# EAGLE design bosch_pressure_v11 (EAGLE 5.09)
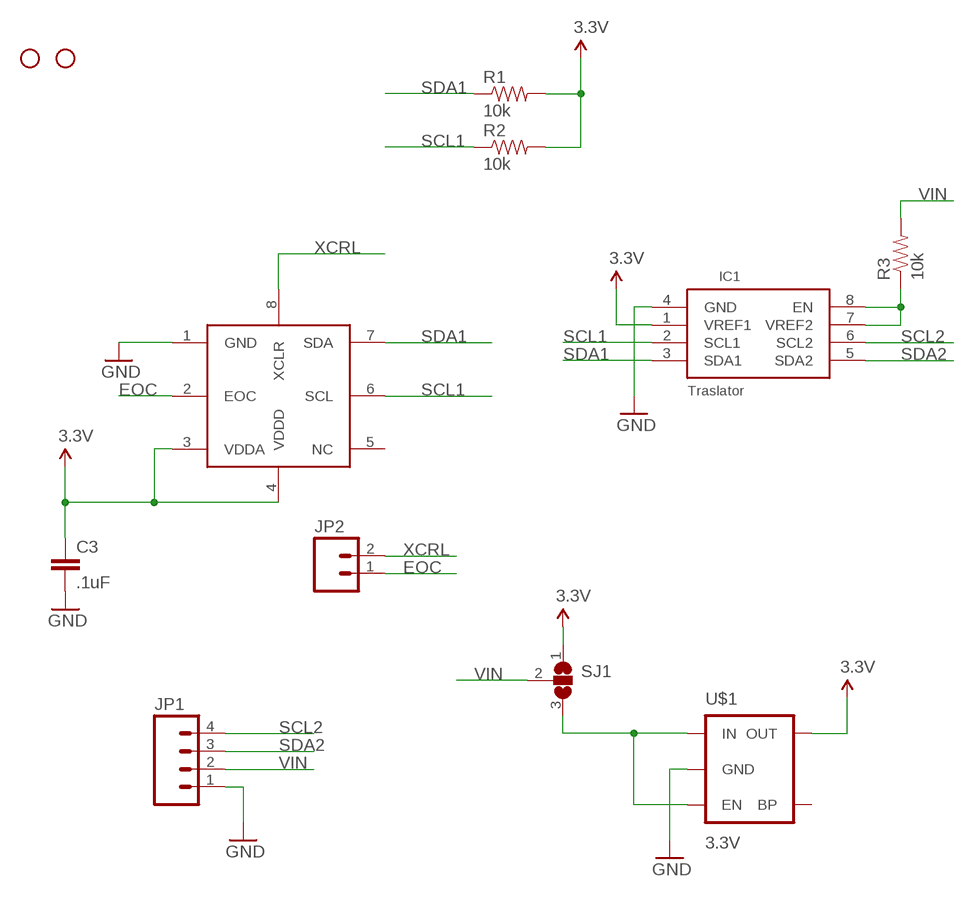
[diagram p0: schematic, sheet 1]

## Parts
C3  .1uF  CAP0402  [C0402]
IC1  Traslator  PCA9306DC  [VSSOP8]
JP1  M04PTH  [1X04]
JP2  M02PTH  [1X02]
R1  10k  RESISTOR0402  [C0402]
R2  10k  RESISTOR0402  [C0402]
R3  10k  RESISTOR0402  [C0402]
SJ1  SOLDERJUMPER_2WAYS  [SJ_3]
U$1  3.3V  V_REG_LDOSMD  [SOT23-5]
U$2  STAND-OFF  [STAND-OFF]
U$3  STAND-OFF  [STAND-OFF]
U$7  BMP085  [BMP085]

## Nets
3.3V: C3.1 IC1.1(VREF1) R1.2 R2.2 SJ1.1 U$1.5(OUT) U$7.3(VDDA) U$7.4(VDDD)
EOC: JP2.1 U$7.2(EOC)
GND: C3.2 IC1.4(GND) JP1.1 U$1.2(GND) U$7.1(GND)
N$1: IC1.7(VREF2) IC1.8(EN) R3.1
N$4: SJ1.3 U$1.1(IN) U$1.3(EN)
SCL1: IC1.2(SCL1) R2.1 U$7.6(SCL)
SCL2: IC1.6(SCL2) JP1.4
SDA1: IC1.3(SDA1) R1.1 U$7.7(SDA)
SDA2: IC1.5(SDA2) JP1.3
VIN: JP1.2 R3.2 SJ1.2
XCRL: JP2.2 U$7.8(XCLR)
Unconnected: U$1.4(BP) U$7.5(NC)

## Library data of the parts
C3 = DIYdrones3:CAP: Capacitor Standard 0603 ceramic capacitor, and 0.1" leaded capacitor.
IC1 = DIYdrones_082610:PCA9306DC
JP1 = SparkFun:M04: Header 4 Standard 4-pin 0.1" header. Use with straight break away headers (SKU : PRT-00116), right angle break away headers (PRT-00553), swiss pins (PRT-00743), machine pins (PRT-00117), and female headers (PRT-00115). Molex polarized connector foot print use with SKU : PRT-08231 with associated crimp pins and housings.
JP2 = SparkFun:M02: Header 2 Standard 2-pin 0.1" header. Use with straight break away headers (SKU : PRT-00116), right angle break away headers (PRT-00553), swiss pins (PRT-00743), machine pins (PRT-00117), and female headers (PRT-00115). Molex polarized connector foot print use with SKU : PRT-08233 with associated crimp pins and housings.
R1-R3 = DIYdrones3:RESISTOR: Resistor Basic schematic elements and footprints for 0603, 1206, and PTH 1/10th watt (small) resistors.
SJ1 = DIYdrones3:SOLDERJUMPER_2WAY: Solder Jumper 2 way solder jumper
U$1 = DIYdrones3:V_REG_LDO: Voltage Regulator LDO Standard 150mA LDO voltage regulator in SOT-23 layout. Micrel part MIC5205. BP (by-pass) pin is used to lower output noise with 470pF cap.
U$2 U$3 = DIYdrones3:STAND-OFF: Stand Off This is the mechanical footprint for a #4 phillips button head screw. Use the keepout ring to avoid running the screw head into surrounding components. SKU : PRT-00447
U$7 = SparkFun:BMP085

## Board
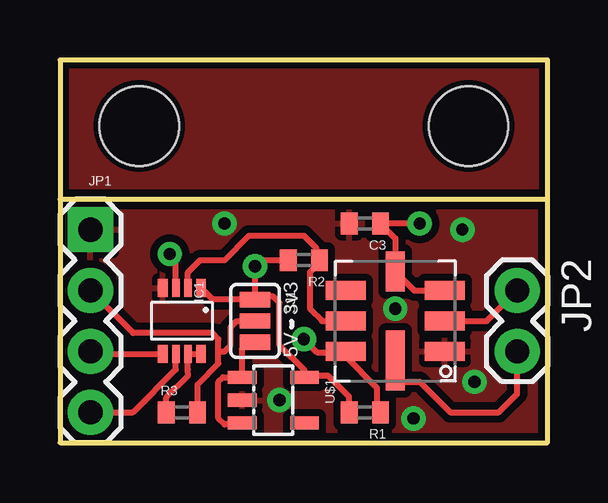
[diagram p1: board, top side]
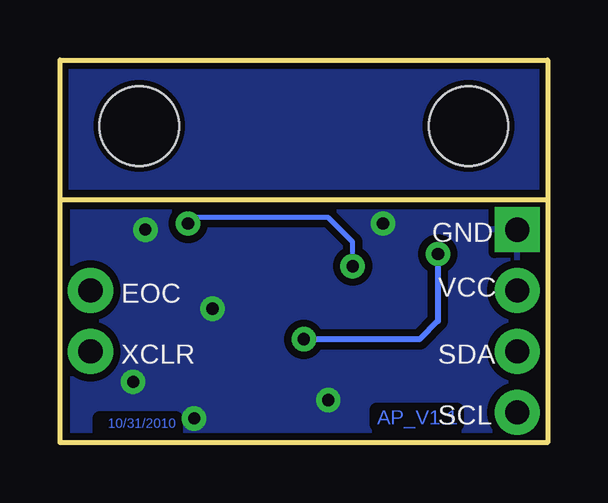
[diagram p2: board, bottom side, seen from below]

Size 20.32 x 15.97 mm. Coordinates in mm from the lower left corner, seen from the top.
Outline: 20.32,10.15 20.32,0 0,0 0,10.15 20.32,10.15
Outline: 0,10.16 0,15.97 20.32,15.97 20.32,10.15
Copper layers (1*16): Top 0.035mm / dielectric 1.5mm / Bottom 0.035mm
Design rules "SparkFun": minimum track width 8mil, minimum drill 20mil, track to track 8mil, track to pad 8mil, pad to pad 8mil, via to via 8mil, smd to smd 8mil, copper to edge 10mil, drill to drill 8mil, minimum pad ring 12mil, minimum via ring 10mil, stop-mask expansion 4mil, vias tented up to drill 25mil, thermal gap 10mil

### Footprints (pad centres in the part's own frame; a part is rotated, then mirrored left to right if it is on the bottom)
C0402 = smd 0.7 x 0.9: 1 -0.65,0; 2 0.65,0
VSSOP8 = smd 0.75 x 0.4: 1 -1.375,0.8; 4 -1.375,-0.8; 5 1.375,-0.8; 8 1.375,0.8 | smd 0.75 x 0.3: 2 -1.375,0.25; 3 -1.375,-0.25; 6 1.375,-0.25; 7 1.375,0.25
1X04 = drill 1.016 pad 1.88 square: 1 0,0 | drill 1.016 pad 1.88 round: 2 2.54,0; 3 5.08,0; 4 7.62,0
1X02 = drill 1.016 pad 1.88 round: 1 0,0; 2 2.54,0
SJ_3 = smd 0.635 x 1.27: 1 -0.889,0; 2 0,0; 3 0.889,0
SOT23-5 = smd 0.55 x 1.2: 1 -0.95,-1.3; 2 0,-1.3; 3 0.95,-1.3; 4 0.95,1.3; 5 -0.95,1.3
STAND-OFF = hole 3.302: 0,0
BMP085 = smd 1.67 x 0.8: 1 -2.065,1.27; 2 -2.065,0; 3 -2.065,-1.27; 5 2.065,-1.27; 6 2.065,0; 7 2.065,1.27 | smd 0.8 x 1.67: 4 0,-2.065 | smd 0.8 x 2.5: 8 0,1.65

### Placement (x,y rotation side)
C3  12.7,9.14 180 top
IC1  5.08,5.08 270 top
JP1  1.27,8.89 270 top
JP2  19.05,6.35 270 top
R1  12.7,1.27 180 top
R2  10.16,7.62 180 top
R3  5.08,1.27 0 top
SJ1  8.13,5.08 270 top
U$1  8.89,1.78 270 top
U$2  3.3,13.21 0 top
U$3  17.02,13.21 0 top
U$7  13.97,5.08 180 top

### Tracks (layer width: path | path; a pad name or v marks a point on that pad's centre or on a via)
3.3V  (via drill 0.51)
  Top 0.254: SJ1.1 8,5.97 | SJ1.1 8,6.1 8.89,6.1 9.14,5.84 9.14,4.06 10.19,3.02 U$1.5 10.26,2.79 11.18,2.79 12.05,1.92 R1.2 | SJ1.1 v8.13,7.37 | C3.1 13.46,9.03 | v14.99,9.14 C3.1 | C3.1 13.97,8.52 U$7.4 14.77,6.35 U$7.3 | v8.13,7.37 8.24,7.48 | SJ1.1 6.37,5.97 IC1.1 | v8.13,7.37 8.27,7.51 | R2.2 8.38,7.62 v8.13,7.37
  Bottom 0.203: v8.13,7.37 8.13,8.38 9.14,9.4 14.73,9.4 v14.99,9.14
EOC
  Top 0.254: U$7.2 17.78,5.08 JP2.1
GND  (via drill 0.51)
  other vias: 6.86,9.14 16.76,8.89 9.14,1.78 14.73,1.02 13.97,5.59 17.27,2.54
  pour Top (isolate 0.305): 0,10.16 20.57,10.16 20.57,0 0,0
  pour Bottom (isolate 0.305): 0,10.16 20.57,10.16 20.57,0 0,0
N$1
  Top 0.254: IC1.8 IC1.7 5.33,3.05 5.33,2.79 4.43,1.89 R3.1
N$4
  Top 0.254: U$1.3 7.02,0.76 6.86,0.76 6.6,1.02 6.6,2.54 6.79,2.73 U$1.1 7.59,3.91 SJ1.3
N$6
  pour Top: 0,16 20.57,16 20.57,10.67 0,10.67
N$7
  pour Bottom: 0,16 20.57,16 20.57,10.67 0,10.67
SCL1
  Top 0.254: U$7.6 10.92,5.08 10.41,5.59 10.41,7.11 10.81,7.51 R2.1 10.67,7.76 10.67,8.13 10.16,8.64 7.87,8.64 6.86,7.62 5.84,7.62 5.33,7.11 IC1.2
SCL2
  Top 0.254: IC1.6 4.83,3.05 3.05,1.27 JP1.4
SDA1  (via drill 0.51)
  Top 0.254: 11.94,3.78 U$7.7 | 11.94,3.78 10.7,3.78 v10.16,4.32 | 11.94,3.78 11.94,3.56 13.21,2.29 13.21,1.41 R1.1 | IC1.3 4.83,7.62 v4.57,7.87
  Bottom 0.254: v10.16,4.32 5.33,4.32 4.57,5.08 v4.57,7.87
SDA2
  Top 0.254: IC1.5 1.38,3.71 JP1.3
VIN
  Top 0.254: 6.6,3.81 6.6,4.32 6.35,4.57 3.05,4.57 JP1.2 | 6.6,3.81 6.86,3.81 7.11,4.06 7.11,4.83 7.37,5.08 SJ1.2 | R3.2 5.73,2.43 6.6,3.3 6.6,3.81
XCRL
  Top 0.254: JP2.2 19.05,2.03 18.29,1.27 16.26,1.27 14.99,2.54 13.97,2.54 U$7.8

### Text on the board
Bottom: AP_V1.1 | 10/31/2010
tPlace: 3v3 | 5V
bPlace: GND | VCC | EOC | SDA | XCLR | SCL